# EasyEDA schematic SCH_Offset_ampop_2023-03-23.json
TITLE: Sheet_1; REV: 1.0; Date: 2023-03-02; Sheet: 1/1; Drawn By: barossvini; Company: Your Company
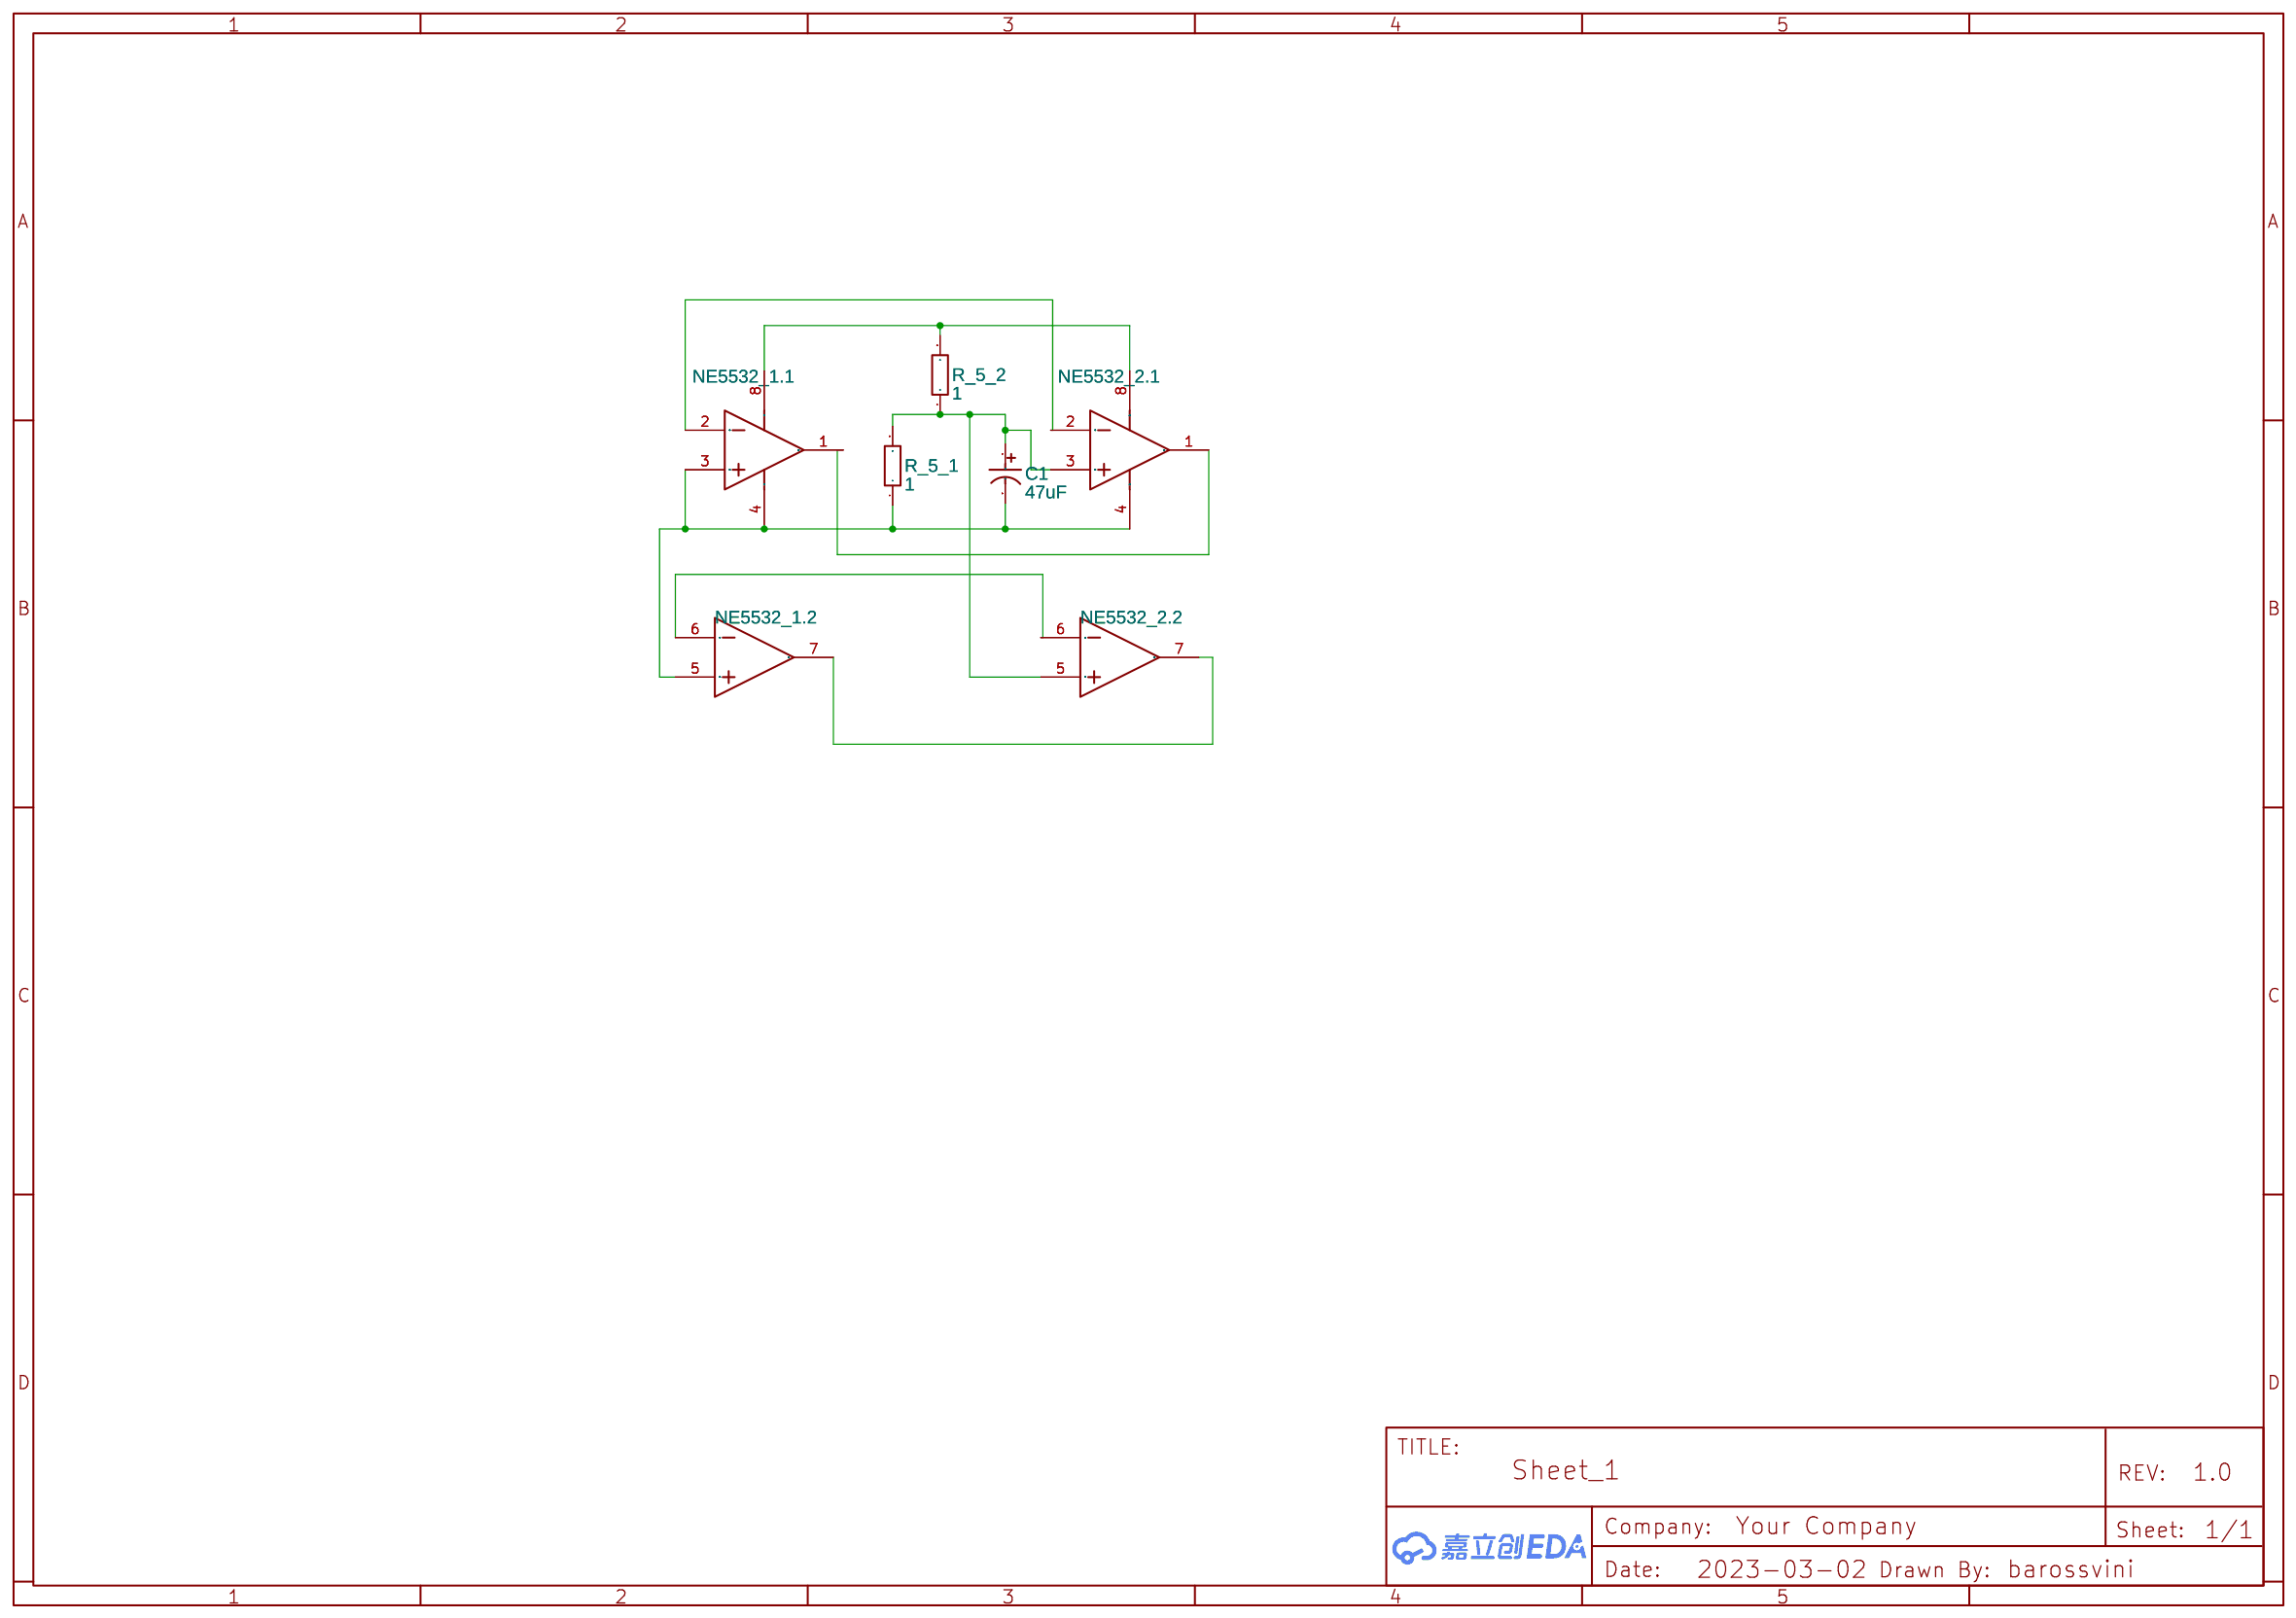
[diagram p0: schematic sheet]

## Parts
C1  47uF  [CAP-TH_BD5.0-P2.00-D0.8-FD]
NE5532_1  LM358P_C5330384  [DIP-8_L9.7-W6.4-P2.54-LS7.6-BL]  (sections 1,2)
NE5532_2  LM358P_C5330384  [DIP-8_L9.7-W6.4-P2.54-LS7.6-BL]  (sections 1,2)
R_5_1  1  [RES-TH_BD2.3-L6.5-P6.9-D0.5]
R_5_2  1  [RES-TH_BD2.3-L6.5-P6.9-D0.5]

## Library data of the parts
C1 = 47uF 16V Aluminum electrolytic capacitors: Supplier: LCSC; Manufacturer: CX(承兴); Manufacturer Part: KM476M016D11RR0VH2FP0; Supplier Part: C22320; JLCPCB Part Class: Extended Part
NE5532_1 NE5532_2 = LM358P_C5330384: Supplier: LCSC; Supplier Part: C5330384; Manufacturer: Slkor(萨科微); Manufacturer Part: LM358P; subpart_no: 1
R_5_1 R_5_2 = RES1/4W33R: Supplier: LCSC; Supplier Part: C9900002916; Manufacturer: null; JLCPCB Part Class: Extended Part; link: https://cn.bing.com/search?q=datasheet%3A+%20RES1/4W33R; Contributor: LCSC

## Nets
Net-(C1-1): C1.1 NE5532_2.3(IN1+) NE5532_2.5(IN2+) R_5_1.2 R_5_2.1
Net-(C1-2): C1.2 NE5532_1.3(IN1+) NE5532_1.4(GND) NE5532_1.5(IN2+) NE5532_2.4(GND) R_5_1.1
Net-(NE5532_1.1-1): NE5532_1.1(OUT1) NE5532_2.1(OUT1)
Net-(NE5532_1.1-2): NE5532_1.2(IN1-) NE5532_2.2(IN1-)
Net-(NE5532_1.1-8): NE5532_1.8(VCC) NE5532_2.8(VCC) R_5_2.2
Net-(NE5532_1.2-6): NE5532_1.6(IN2-) NE5532_2.6(IN2-)
Net-(NE5532_1.2-7): NE5532_1.7(OUT2) NE5532_2.7(OUT2)
